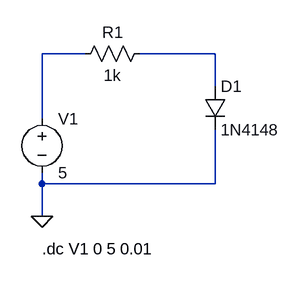
[diagram p0: schematic Assignment 2_2.asc]
Assignment 2_2.asc, the LTspice schematic file:
Version 4.1
SHEET 1 932 680
WIRE 128 64 64 64
WIRE 320 64 208 64
WIRE 320 112 320 64
WIRE 64 160 64 64
WIRE 64 256 64 240
WIRE 320 256 320 176
WIRE 320 256 64 256
WIRE 64 304 64 256
FLAG 64 304 0
SYMBOL voltage 64 144 R0
WINDOW 123 0 0 Left 2
WINDOW 39 0 0 Left 2
SYMATTR InstName V1
SYMATTR Value 5
SYMBOL res 224 48 R90
WINDOW 0 0 56 VBottom 2
WINDOW 3 32 56 VTop 2
SYMATTR InstName R1
SYMATTR Value 1k
SYMBOL diode 304 112 R0
SYMATTR InstName D1
SYMATTR Value 1N4148
TEXT 64 352 Left 2 !.dc V1 0 5 0.01

The netlist it stands for:
* Assignment 2_2.asc
V1 N001 0 5
R1 N002 N001 1k
D1 N002 0 1N4148
.model D D
.lib standard.dio
.dc V1 0 5 0.01
.backanno
.end